# EAGLE design IFS2DSM (EAGLE 6.5.0)
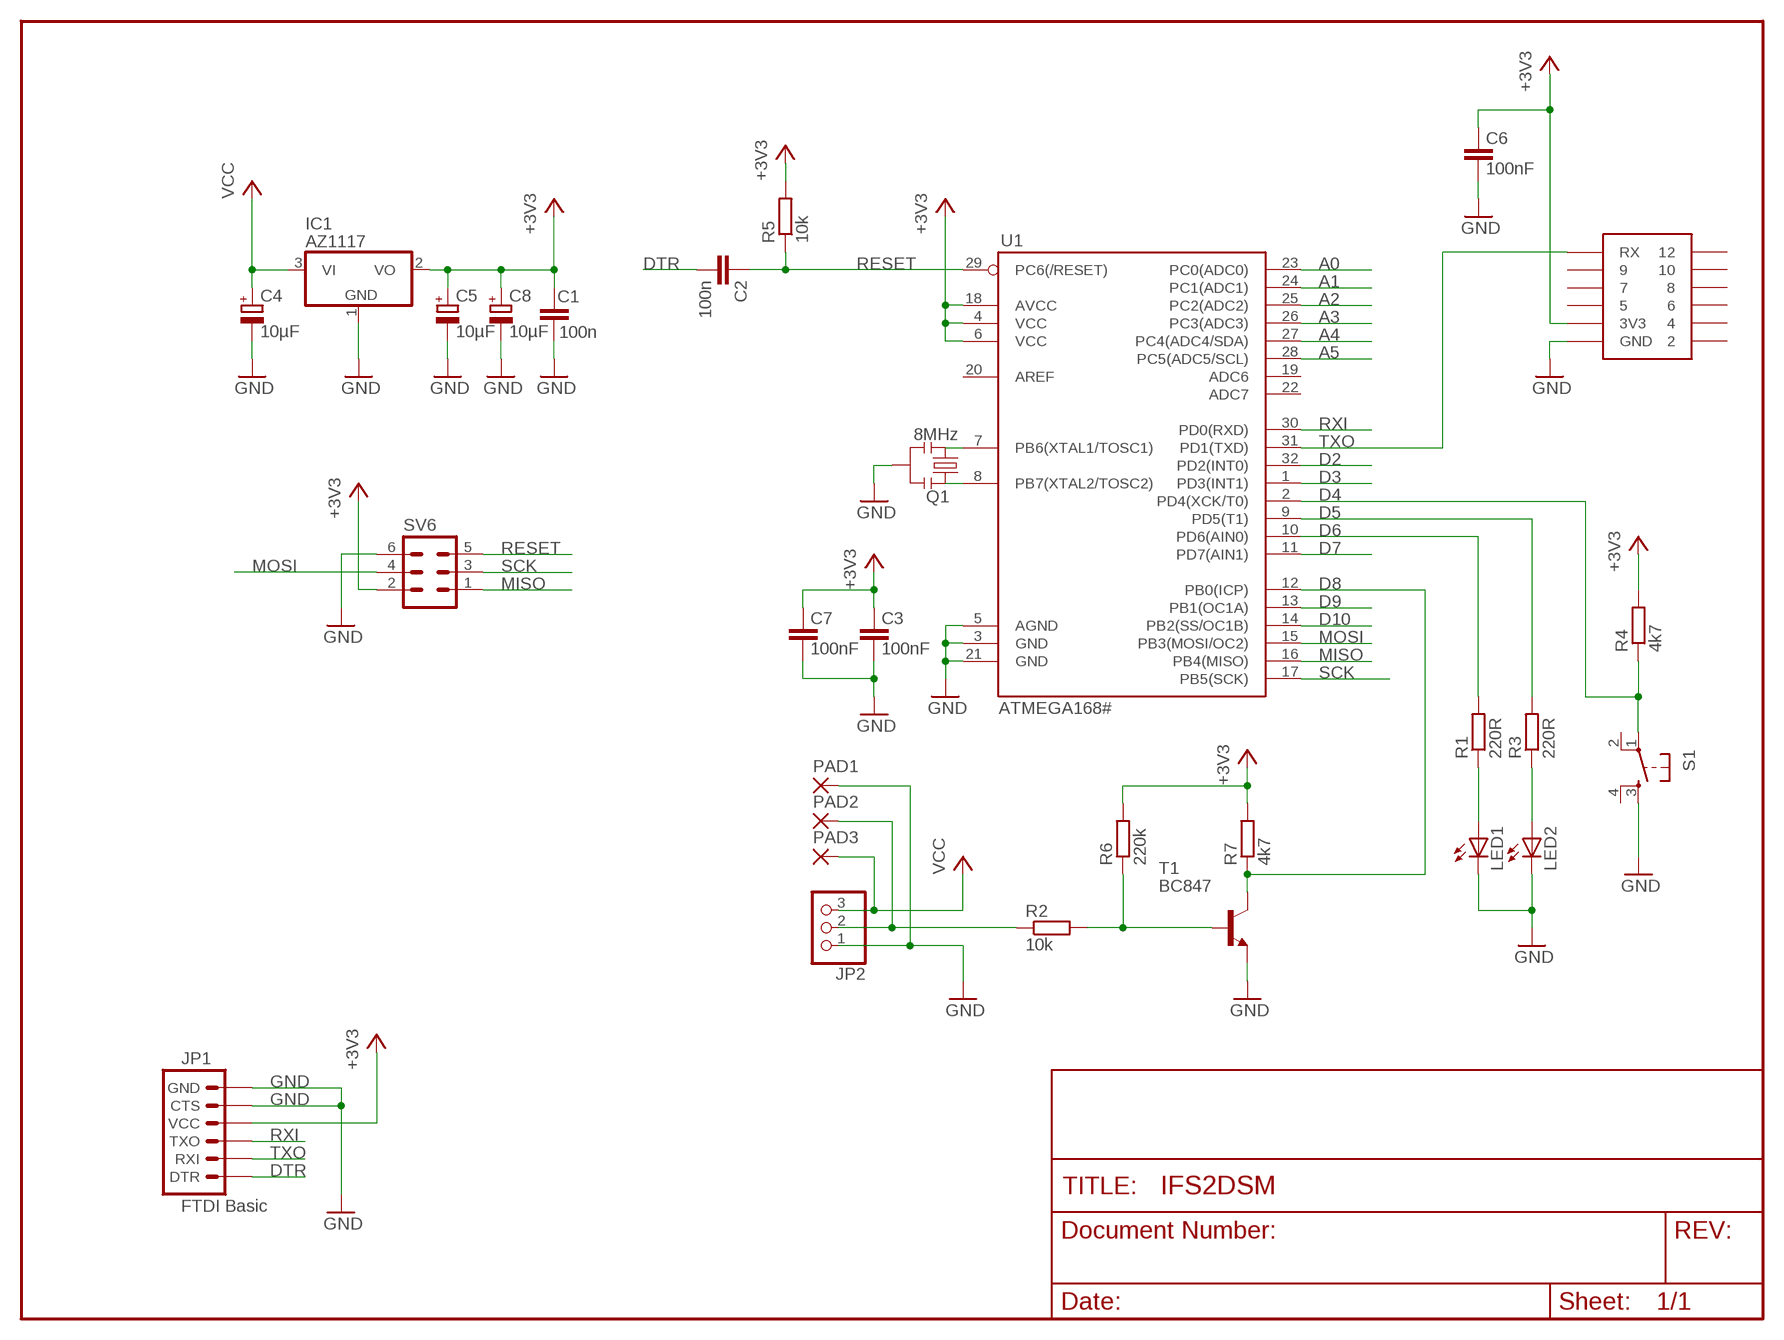
[diagram p0: schematic, sheet 1]

## Parts
C1  100n  C-EUC0805  [C0805]
C2  100n  C-EUC0805  [C0805]
C3  100nF  C-EUC0805  [C0805]
C4  10µF  CPOL-EUCT6032  [CT6032]
C5  10µF  CPOL-EUCT6032  [CT6032]
C6  100nF  C-EUC0805  [C0805]
C7  100nF  C-EUC0805  [C0805]
C8  10µF  CPOL-EUCT6032  [CT6032]
IC1  AZ1117  [SOT223]
IC3  X1TX0  [X1TX0]
JP1  FTDI Basic  ARDUINO_SERIAL_PROGRAMPTH  [1X06]
JP2  PINHD-1X3_2.00  [1X03M]
LED1  LEDSML0805  [SML0805]
LED2  LEDSML0805  [SML0805]
PAD1  SMD2  [SMD1,27-2,54]
PAD2  SMD2  [SMD1,27-2,54]
PAD3  SMD2  [SMD1,27-2,54]
Q1  8MHz  RESONATORSMD  [RESONATOR-SMD]
R1  220R  R-EU_R0805  [R0805]
R2  10k  R-EU_R0805  [R0805]
R3  220R  R-EU_R0805  [R0805]
R4  4k7  R-EU_R0805  [R0805]
R5  10k  R-EU_R0805  [R0805]
R6  220k  R-EU_R0805  [R0805]
R7  4k7  R-EU_R0805  [R0805]
S1  10-XXTASTERSMD  [SMD]
SV6  MA03-2  [MA03-2]
T1  BC847  [SOT23]
U1  ATMEGA168#  ATMEGA168  [TQFP32-08]

## Nets
+3V3: C1.2 C3.2 C5.+ C6.2 C7.2 C8.+ IC1.2(VO) IC3.3(3V3) JP1.4(VCC) R4.2 R5.2 R6.2 R7.2 SV6.2 U1.4(VCC) U1.6(VCC) U1.18(AVCC)
A0: U1.23(PC0(ADC0))
A1: U1.24(PC1(ADC1))
A2: U1.25(PC2(ADC2))
A3: U1.26(PC3(ADC3))
A4: U1.27(PC4(ADC4/SDA))
A5: U1.28(PC5(ADC5/SCL))
D2: U1.32(PD2(INT0))
D3: U1.1(PD3(INT1))
D4: R4.1 S1.1(P) U1.2(PD4(XCK/T0))
D5: R3.2 U1.9(PD5(T1))
D6: R1.2 U1.10(PD6(AIN0))
D7: U1.11(PD7(AIN1))
D8: R7.1 T1.3(C) U1.12(PB0(ICP))
D9: U1.13(PB1(OC1A))
D10: U1.14(PB2(SS/OC1B))
DTR: C2.2 JP1.1(DTR)
GND [vcc]: C1.1 C3.1 C4.- C5.- C6.1 C7.1 C8.- IC1.1(GND) IC3.1(GND) JP1.5(CTS) JP1.6(GND) JP2.1 LED1.C LED2.C PAD1.1(P) Q1.2 S1.3(S) SV6.6 T1.2(E) U1.3(GND) U1.5(AGND) U1.21(GND)
MISO: SV6.1 U1.16(PB4(MISO))
MOSI: SV6.4 U1.15(PB3(MOSI/OC2))
N$1: Q1.1 U1.8(PB7(XTAL2/TOSC2))
N$2: Q1.3 U1.7(PB6(XTAL1/TOSC1))
N$4: LED2.A R3.1
N$5: R2.2 R6.1 T1.1(B)
N$6: JP2.2 PAD2.1(P) R2.1
N$7: LED1.A R1.1
RESET: C2.1 R5.1 SV6.5 U1.29(PC6(/RESET))
RXI: JP1.3(TXO) U1.30(PD0(RXD))
SCK: SV6.3 U1.17(PB5(SCK))
TXO: IC3.11(RX) JP1.2(RXI) U1.31(PD1(TXD))
VCC: C4.+ IC1.3(VI) JP2.3 PAD3.1(P)
Unconnected: IC3.5 IC3.6 IC3.7 IC3.8 IC3.9 IC3.10 IC3.12 S1.2(P1) S1.4(S1) U1.19(ADC6) U1.20(AREF) U1.22(ADC7)

## Power pins joined to a net without a drawn wire
2: IC3.2
4: IC3.4

## Library data of the parts
C1-C3 C6 C7 = rcl:C-EU: CAPACITOR, European symbol
C4 C5 C8 = rcl:CPOL-EU: POLARIZED CAPACITOR, European symbol
IC1 = linear:AZ1117
IC3 = Spektrum:X1TX0
JP1 = SparkFun:ARDUINO_SERIAL_PROGRAM
JP2 = pinhead_2:PINHD-1X3: PIN HEADER
LED1 LED2 = led:LED: LED OSRAM: - CHIPLED LG R971, LG N971, LY N971, LG Q971, LY Q971, LO R971, LY R971 LH N974, LH R974 LS Q976, LO Q976, LY Q976 LO Q996 - Hyper CHIPLED LW Q18S LB Q993, LB Q99A, LB R99A - SideLED LS A670, LO A670, LY A670, LG A670, LP A670 LB A673, LV A673, LT A673, LW A673 LH A674 LY A675 LS A676, LA A676, LO A676, LY A676, LW A676 LS A679, LY A679, LG A679 - Hyper Micro SIDELED® LS Y876, LA Y876, LO Y876, LY Y876 LT Y87S - SmartLED LW L88C, LW L88S LB L89C, LB L89S, LG L890 LS L89K, LO L89K, LY L89K LS L896, LA L896, LO L896, LY L896 - TOPLED LS T670, LO T670, LY T670, LG T670, LP T670 LSG T670, LSP T670, LSY T670, LOP T670, LYG T670 LG T671, LOG T671, LSG T671 LB T673, LV T673, LT T673, LW T673 LH T674 LS T676, LA T676, LO T676, LY T676, LB T676, LH T676, LSB T676, LW T676 LB T67C, LV T67C, LT T67C, LS T67K, LO T67K, LY T67K, LW E67C LS E67B, LA E67B, LO E67B, LY E67B, LB E67C, LV E67C, LT E67C LW T67C LS T679, LY T679, LG T679 LS T770, LO T770, LY T770, LG T770, LP T770 LB T773, LV T773, LT T773, LW T773 LH T774 LS E675, LA E675, LY E675, LS T675 LS T776, LA T776, LO T776, LY T776, LB T776 LHGB T686 LT T68C, LB T68C - Hyper Mini TOPLED® LB M676 - Mini TOPLED Santana® LG M470 LS M47K, LO M47K, LY M47K Source: http://www.osram.convergy.de LUXEON: - LUMILED® LXK2-PW12-R00, LXK2-PW12-S00, LXK2-PW14-U00, LXK2-PW14-V00 LXK2-PM12-R00, LXK2-PM12-S00, LXK2-PM14-U00 LXK2-PE12-Q00, LXK2-PE12-R00, LXK2-PE12-S00, LXK2-PE14-T00, LXK2-PE14-U00 LXK2-PB12-K00, LXK2-PB12-L00, LXK2-PB12-M00, LXK2-PB14-N00, LXK2-PB14-P00, LXK2-PB14-Q00 LXK2-PR12-L00, LXK2-PR12-M00, LXK2-PR14-Q00, LXK2-PR14-R00 LXK2-PD12-Q00, LXK2-PD12-R00, LXK2-PD12-S00 LXK2-PH12-R00, LXK2-PH12-S00 LXK2-PL12-P00, LXK2-PL12-Q00, LXK2-PL12-R00 Source: www.luxeon.com KINGBRIGHT: KA-3528ASYC Source: www.kingbright.com
PAD1-PAD3 = wirepad:SMD2: SMD PAD
Q1 = SparkFun:RESONATOR: Resonator Small SMD resonator. This is the itty bitty 10/20MHz resonators with built in caps. CSTCE10M0G55 and CSTCE20M0V53. Footprint has been reviewed closely but hasn't been tested yet.
R1-R7 = rcl:R-EU_: RESISTOR, European symbol
S1 = switch-omron:10-XX: OMRON SWITCH
SV6 = con-lstb:MA03-2: PIN HEADER; OC_FARNELL: unknown; OC_NEWARK: unknown
T1 = transistor:BC847: NPN TRANSISTOR
U1 = SparkFun:ATMEGA168

## Net classes
0 default: width 0.203 mm
1 vcc: width 0.254 mm

## Board
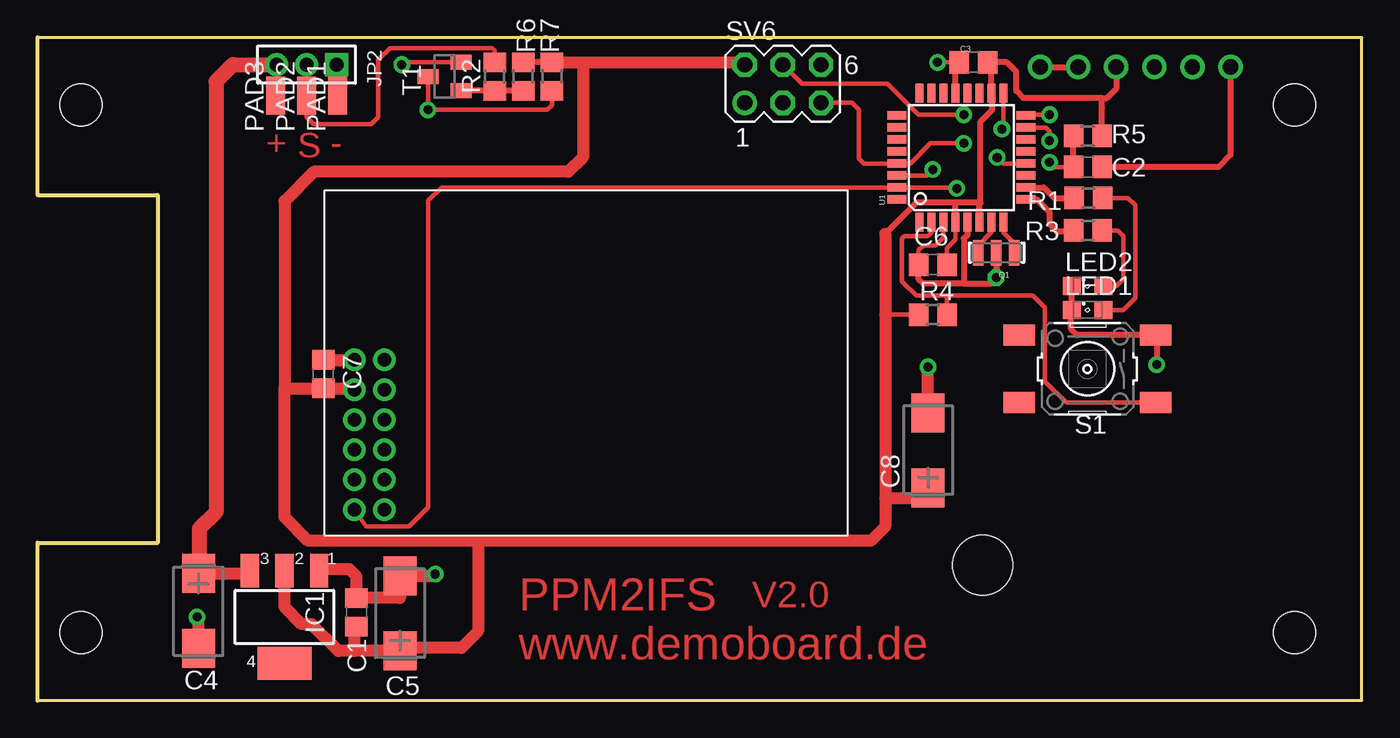
[diagram p1: board, top side]
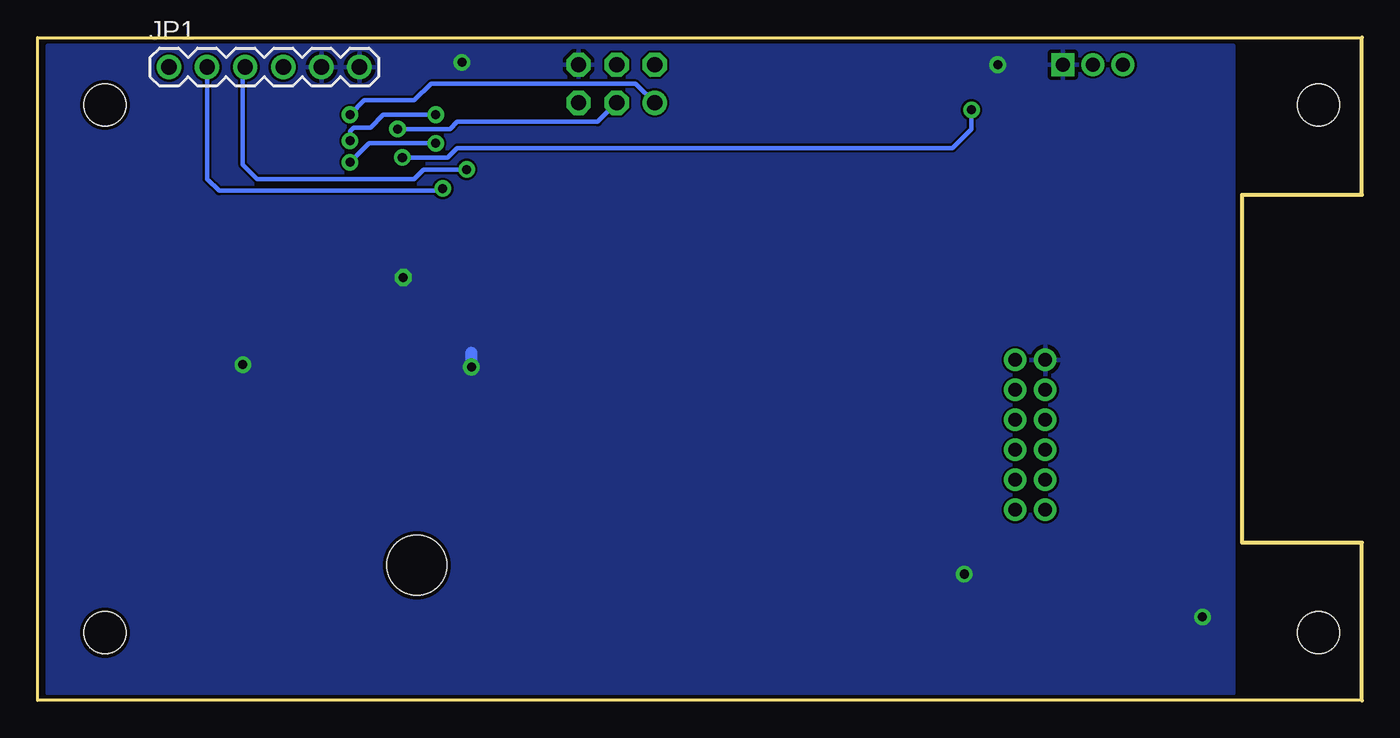
[diagram p2: board, bottom side, seen from below]

Size 88.3 x 44.2 mm. Coordinates in mm from the lower left corner, seen from the top.
Outline: 0,0 88.3,0 88.3,44.2 0,44.2 0,33.7 8,33.7 8,10.5 0,10.5 0,0
Copper layers (1*16): Top 0.035mm / dielectric 1.5mm / Bottom 0.035mm
Design rules "DerPlatinenbelichter": minimum track width 0.15mm, minimum drill 0.6mm, track to track 0.15mm, track to pad 0.15mm, pad to pad 0.15mm, via to via 0.15mm, smd to smd 0.15mm, copper to edge 10mil, drill to drill 8mil, minimum pad ring 12mil, minimum via ring 10mil, stop-mask expansion 4mil, vias tented up to drill 20mil, thermal gap 10mil
Holes 2.8 mm at 2.9,39.7 2.9,4.5 83.8,4.5 83.8,39.7
Holes 4 mm at 63,9

### Footprints (pad centres in the part's own frame; a part is rotated, then mirrored left to right if it is on the bottom)
C0805 = smd 1.3 x 1.5: 1 -0.95,0; 2 0.95,0
CT6032 = smd 2.6 x 2.2: + -2.5,0; - 2.5,0
SOT223 = smd 1.219 x 2.235: 1 -2.311,-3.099; 2 0,-3.099; 3 2.311,-3.099 | smd 3.6 x 2.2: 4 0,3.099
X1TX0 = drill 0.9: 1 0,0; 2 0,2; 3 2,0; 4 2,2; 5 4,0; 6 4,2; 7 6,0; 8 6,2; 9 8,0; 10 8,2; 11 10,0; 12 10,2
1X06 = drill 1.016: 1 0,0; 2 2.54,0; 3 5.08,0; 4 7.62,0; 5 10.16,0; 6 12.7,0
1X03M = drill 0.914 square: 1 -2,0 | drill 0.914: 2 0,0; 3 2,0
SML0805 = smd 1.2 x 1.2: A 1.05,0; C -1.05,0
SMD1,27-2,54 = smd 1.27 x 2.54: 1 0,0
RESONATOR-SMD = smd 0.7 x 1.7: 1 -1.2,0; 2 0,0; 3 1.2,0
R0805 = smd 1.3 x 1.5: 1 -0.95,0; 2 0.95,0
SMD = smd 2.1 x 1.4: 1 -4.55,2.25; 2 4.55,2.25; 3 -4.55,-2.25; 4 4.55,-2.25
MA03-2 = drill 1.016: 1 -2.54,-1.27 | drill 1.016 octagon: 2 -2.54,1.27; 3 0,-1.27; 4 0,1.27; 5 2.54,-1.27; 6 2.54,1.27
SOT23 = smd 1 x 1.4: 1 -0.95,-1.1; 2 0.95,-1.1; 3 0,1.1
TQFP32-08 = smd 1.27 x 0.559: 1 -4.293,2.8; 2 -4.293,2; 3 -4.293,1.2; 4 -4.293,0.4; 5 -4.293,-0.4; 6 -4.293,-1.2; 7 -4.293,-2; 8 -4.293,-2.8; 17 4.293,-2.8; 18 4.293,-2; 19 4.293,-1.2; 20 4.293,-0.4; 21 4.293,0.4; 22 4.293,1.2; 23 4.293,2; 24 4.293,2.8 | smd 0.559 x 1.27: 9 -2.8,-4.293; 10 -2,-4.293; 11 -1.2,-4.293; 12 -0.4,-4.293; 13 0.4,-4.293; 14 1.2,-4.293; 15 2,-4.293; 16 2.8,-4.293; 25 2.8,4.293; 26 2,4.293; 27 1.2,4.293; 28 0.4,4.293; 29 -0.4,4.293; 30 -1.2,4.293; 31 -2,4.293; 32 -2.8,4.293

### Placement (x,y rotation side)
C1  21.27,5.87 270 top
C2  70.01,35.56 0 top
C3  62.39,42.55 0 top
C4  10.73,5.95 270 top
C5  24.16,5.79 90 top
C6  59.69,29.05 0 top
C7  19.05,21.75 270 top
C8  59.37,16.67 90 top
IC1  16.46,5.56 180 top
IC3  21.11,22.7 270 top
JP1  79.53,42.23 0 bottom
JP2  17.94,42.39 180 top
LED1  70.01,26.04 0 top
LED2  70.01,27.62 0 top
PAD1  20,40.32 0 top
PAD2  17.94,40.32 0 top
PAD3  15.88,40.32 0 top
Q1  63.91,29.84 180 top
R1  70.06,33.5 180 top
R2  30.48,41.59 270 top
R3  70.03,31.32 180 top
R4  59.69,25.72 180 top
R5  70.01,37.62 0 top
R6  32.38,41.59 90 top
R7  34.29,41.59 90 top
S1  70,22.1 180 top
SV6  49.69,41.12 0 top
T1  27.15,41.59 90 top
U1  61.59,36.2 90 top

### Tracks (layer width: path | path; a pad name or v marks a point on that pad's centre or on a via)
+3V3
  Top 0.305: U1.4 61.2,30.71 60.64,30.16 C6.2 | R4.2 56.52,25.72
  Top 0.406: R7.2 R6.2 | JP1.4 71.91,40.8 71.28,40.16 70.96,40.16 | 62.87,33.18 62.87,38.58 63.66,39.37 63.66,40.42 U1.18 63.59,42.29 C3.2 64.61,42.55 65.25,41.91 65.25,40.64 65.72,40.16 70.96,40.16 | U1.6 62.8,33.11 62.87,33.18 | R5.2 70.96,39.53 70.96,40.16 | 62.87,33.18 61.2,33.18 | 61.2,33.18 58.58,33.18 56.52,31.11 | U1.4 61.2,33.18
  Top 0.813: 21.11,3.29 C5.+ 24.36,3.49 28.26,3.49 29.37,4.6 29.37,10.64 | 21.11,3.29 20.04,3.29 18.26,5.08 17.62,5.08 16.46,6.24 IC1.2 | C1.2 21.11,4.76 21.11,3.29 | 16.46,20.8 18.89,20.8 C7.2 21.11,20.8 IC3.3 | R7.2 36.35,42.54 | 36.35,42.54 36.35,36.2 35.4,35.24 18.41,35.24 16.46,33.29 16.46,20.8 | 36.35,42.54 46.99,42.54 SV6.2 | 59.37,14.13 58.7,13.49 | 56.52,13.49 56.52,11.59 55.56,10.64 29.37,10.64 | 29.37,10.64 18.05,10.64 16.46,12.22 16.46,20.8 | 56.52,31.11 56.52,25.72 56.52,13.49 | 56.52,13.49 58.7,13.49 | 58.7,13.49 C8.+
D4
  Top 0.305: U1.2 59.59,31.18 59.37,30.96 57.78,30.96 57.63,30.8 57.63,27.94 58.58,26.99 60.48,26.99 | 60.48,26.99 66.36,26.99 67.15,26.19 67.15,21.27 68.58,19.84 S1.1 | R4.1 60.64,26.83 60.48,26.99
  Top 0.406: S1.1
D5
  Top 0.406: U1.9 66.62,33.4 67.47,32.54 67.47,31.75 67.94,31.27 69.03,31.27 R3.2
D6
  Top 0.406: U1.10 67.09,34.2 67.78,33.5 R1.2
D8  (via drill 0.6)
  Top 0.305: U1.12 64.38,35.8 v63.98,36.2 | T1.3 26.04,41.58 v26.04,39.37 33.97,39.37 34.29,39.69 R7.1
  Bottom 0.305: v63.98,36.2 60.96,36.2 60.33,36.83 27.3,36.83 26.04,38.1 v26.04,39.37
DTR
  Top 0.406: JP1.1 79.53,36.35 78.74,35.56 C2.2
GND  (via drill 0.6)
  Top 0.305: T1.2 24.45,42.54 v24.29,42.39 | v60.01,42.55 C3.1 | C6.1 58.74,30.01 59.05,30.32 59.85,30.32 60.4,30.87 U1.3 | JP2.1 19.94,40.39 PAD1.1
  Top 0.406: LED2.C LED1.C 68.9,25.97 68.9,24.77 69.31,24.35 S1.3 74.61,24.29 v74.61,22.38 | U1.21 61.2,42.3 C3.1 | JP1.6 JP1.5 | Q1.2 v63.91,28.19 63.5,27.78 61.75,27.78 | U1.5 61.99,31.04 61.75,30.8 61.75,27.78 | 61.75,27.78 59.05,27.78 58.74,28.1 C6.1
  Top 0.813: IC1.1 18.85,8.73 20.8,8.73 21.27,8.26 C1.1 24.16,6.82 C5.- 26.51,8.29 v26.51,8.41 | C4.- 10.73,5.46 v10.64,5.56 | C8.- v59.37,22.23 | C7.1 IC3.1
  Bottom 0.406: v63.91,28.19 63.98,28.26
  Bottom 0.813: v59.37,22.23 59.37,23.18
  pour Bottom: 8.57,43.66 87.63,43.66 87.63,0.48 8.57,0.48
MISO  (via drill 0.6)
  Top 0.305: v67.47,39.05 65.94,39.05 U1.16
  Bottom 0.305: SV6.1 48.42,41.12 62.07,41.12 63.18,40.01 66.52,40.01 v67.47,39.05
MOSI  (via drill 0.6)
  Top 0.305: SV6.4 50.96,41.12 56.67,41.12 58.74,39.05 v61.75,39.05 | U1.15 67.22,38.2 67.47,37.94 v67.47,37.31
  Bottom 0.305: v61.75,39.05 65.25,39.05 66.1,38.2 67.22,38.2 67.47,37.94 v67.47,37.31
N$1
  Top 0.305: Q1.1 65.11,30.45 64.39,31.17 U1.8
N$2
  Top 0.305: Q1.3 62.71,30.33 63.59,31.21 U1.7
N$4
  Top 0.305: R3.1 72.02,31.32 72.39,30.96 72.39,28.1 71.91,27.62 LED2.A
N$5
  Top 0.406: R6.1 R2.2 T1.1
N$6
  Top 0.305: R2.1 30.48,43.34 30.32,43.5 23.5,43.5 22.7,42.7 22.7,38.89 22.23,38.42 18.41,38.42 17.94,38.89 PAD2.1 JP2.2
N$7
  Top 0.305: R1.1 72.71,33.5 73.18,33.02 73.18,26.83 72.39,26.04 LED1.A
RESET  (via drill 0.6)
  Top 0.305: SV6.5 54.29,39.85 54.77,39.37 54.77,36.11 55.09,35.8 U1.29 58.18,35.8 59.53,37.15 v61.75,37.15 | v67.47,35.88 67.79,35.56 C2.1
  Top 0.406: C2.1 R5.1
  Bottom 0.305: v67.47,35.88 66.2,37.15 v61.75,37.15
RXI  (via drill 0.6)
  Top 0.305: U1.30 59.28,34.99 v59.69,35.4
  Bottom 0.305: JP1.3 74.61,42.07 74.61,35.72 73.66,34.77 63.18,34.77 62.55,35.4 v59.69,35.4
SCK  (via drill 0.6)
  Top 0.305: U1.17 64.39,38.2 v64.29,38.1
  Bottom 0.305: SV6.3 50.96,38.58 60.33,38.58 60.8,38.1 v64.29,38.1
TXO  (via drill 0.6)
  Top 0.305: IC3.11 21.91,11.59 24.77,11.59 26.04,12.86 26.04,33.31 26.92,34.2 U1.31 61.21,34.2 v61.28,34.13
  Bottom 0.305: JP1.2 76.99,34.77 76.2,33.97 61.44,33.97 v61.28,34.13
VCC
  Top 0.305: JP2.3 15.94,40.39 PAD3.1
  Top 0.813: C4.+ 14.15,8.45 IC1.3
  Top 1.016: C4.+ 10.79,8.52 10.79,11.43 11.91,12.54 11.91,41.27 13.02,42.39 JP2.3

### Text on the board
Top: + | S | - | V2.0 | PPM2IFS / www.demoboard.de
tValues: Tent Vias! | Arduino Wee v1.3